# Altium schematic sheet systematic.SchDoc
size A4; SheetNumber: 1; SheetTotal: 1
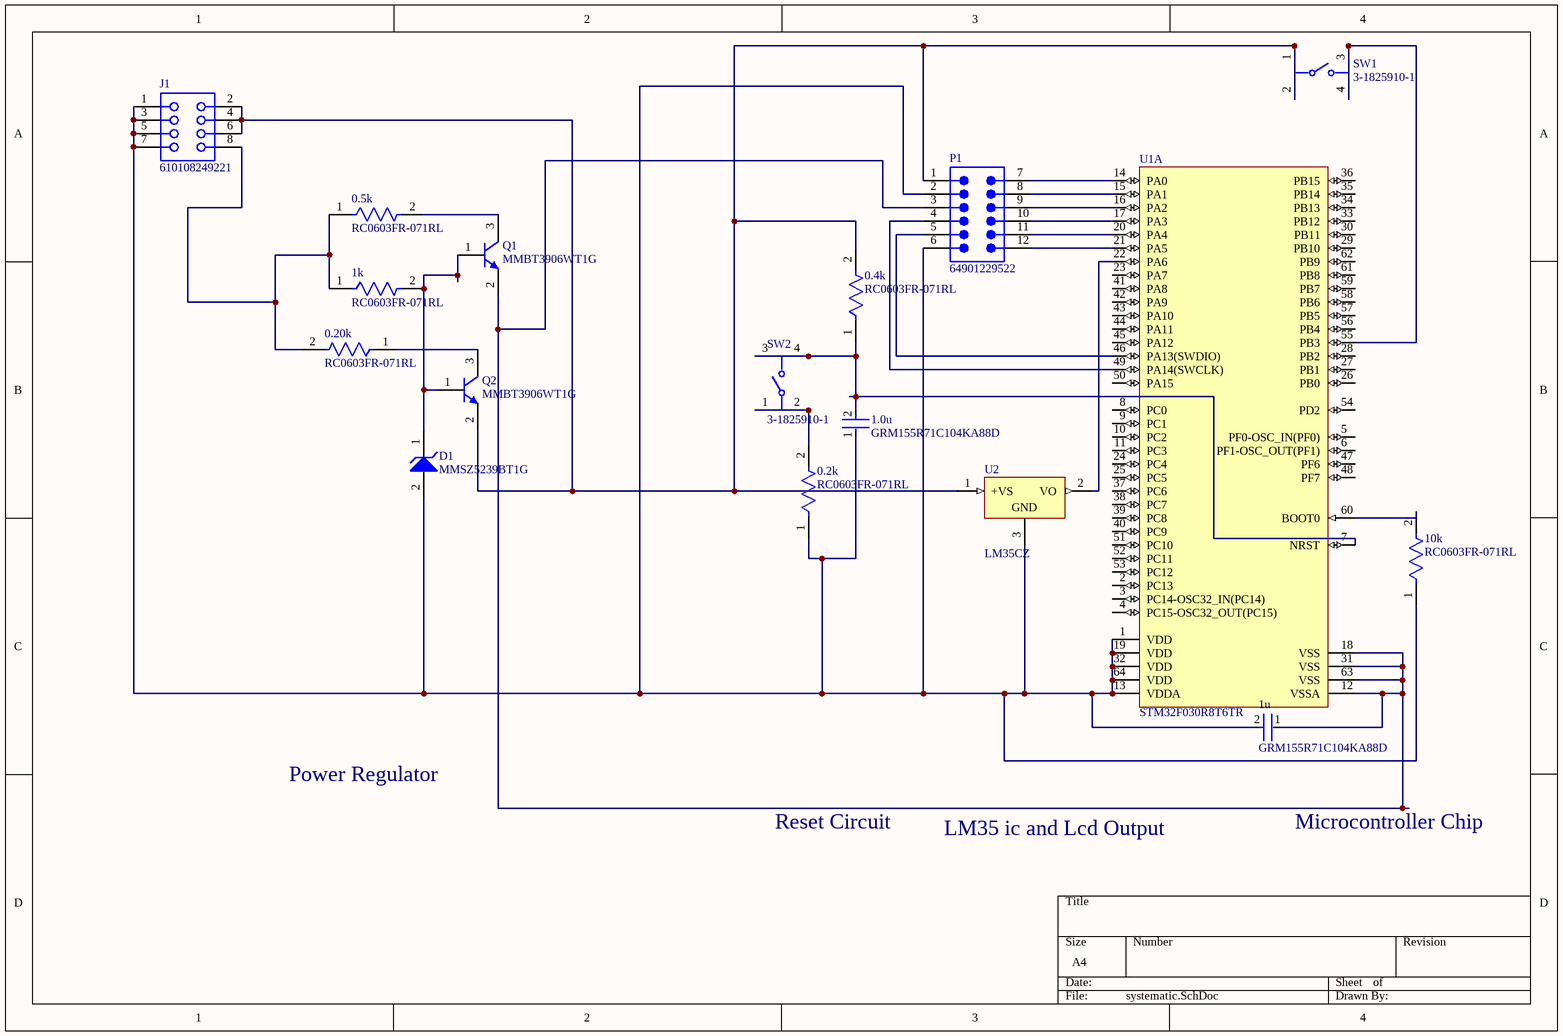
[diagram p0: systematic.SchDoc]

## Parts
0.2k  RC0603FR-071RL  [FP-RC0603-0_55-MFG]
0.4k  RC0603FR-071RL  [FP-RC0603-0_55-MFG]
0.5k  RC0603FR-071RL  [FP-RC0603-0_55-MFG]
0.20k  RC0603FR-071RL  [FP-RC0603-0_55-MFG]
1.0u  GRM155R71C104KA88D  [FP-GRM15-MFG]
1k  RC0603FR-071RL  [FP-RC0603-0_55-MFG]
1u  GRM155R71C104KA88D  [FP-GRM15-MFG]
10k  RC0603FR-071RL  [FP-RC0603-0_55-MFG]
D1  MMSZ5239BT1G  [ONSC-SOD-123-2-425-04_V]
J1  610108249221  [610108249221]
P1  64901229522  [64901229522]
Q1  MMBT3906WT1G  [ONSC-SC-70-3-419-04_V]
Q2  MMBT3906WT1G  [ONSC-SC-70-3-419-04_V]
SW1  3-1825910-1  [FP-3-1825910-1-MFG]
SW2  3-1825910-1  [FP-3-1825910-1-MFG]
U1  STM32F030R8T6TR  [STM-LQFP64_L]  (part A of 2)
U2  LM35CZ  [Z03A]

## Nets
Net0.2k_1: 0.2k.1 1.0u.1 1u.2 10k.1 D1.2(A) J1.1 J1.3 J1.5 J1.7 P1.2 P1.6 U1.1(VDD) U1.13(VDDA) U1.19(VDD) U1.32(VDD) U1.64(VDD) U2.3(GND)
Net0.2k_2: 0.2k.2 SW2.1 SW2.2
Net0.4k_1: 0.4k.1 1.0u.2 SW2.3 SW2.4 U1.7(NRST)
Net0.4k_2: 0.4k.2 J1.2 J1.4 J1.6 P1.1 Q2.2(E) SW1.1 SW1.2 U2.1(+VS)
Net0.5k_1: 0.5k.1 0.20k.2 1k.1 J1.8
Net0.5k_2: 0.5k.2 Q1.3(C)
Net0.20k_1: 0.20k.1 Q2.3(C)
Net1k_2: 1k.2 D1.1(K) Q1.1(B) Q2.1(B)
Net1u_1: 1u.1 P1.3 Q1.2(E) U1.12(VSSA) U1.18(VSS) U1.31(VSS) U1.63(VSS)
Net10k_2: 10k.2 U1.60(BOOT0)
NetP1_4: P1.4 U1.49(PA14(SWCLK))
NetP1_5: P1.5 U1.46(PA13(SWDIO))
NetP1_7: P1.7 U1.14(PA0)
NetP1_8: P1.8 U1.15(PA1)
NetP1_9: P1.9 U1.16(PA2)
NetP1_10: P1.10 U1.17(PA3)
NetP1_11: P1.11 U1.20(PA4)
NetP1_12: P1.12 U1.21(PA5)
NetSW1_3: SW1.3 SW1.4 U1.55(PB3)
NetU1_22: U1.22(PA6) U2.2(VO)

Not connected (* = marked no-connect by the designer): U1 2(PC13) 3(PC14-OSC32_IN(PC14)) 4(PC15-OSC32_OUT(PC15)) 5(PF0-OSC_IN(PF0)) 6(PF1-OSC_OUT(PF1)) 8(PC0) 9(PC1) 10(PC2) 11(PC3) 23(PA7) 24(PC4) 25(PC5) 26(PB0) 27(PB1) 28(PB2) 29(PB10) 30(PB11) 33(PB12) 34(PB13) 35(PB14) 36(PB15) 37(PC6) 38(PC7) 39(PC8) 40(PC9) 41(PA8) 42(PA9) 43(PA10) 44(PA11) 45(PA12) 47(PF6) 48(PF7) 50(PA15) 51(PC10) 52(PC11) 53(PC12) 54(PD2) 56(PB4) 57(PB5) 58(PB6) 59(PB7) 61(PB8) 62(PB9)

## Notes on the sheet
- Power Regulator
- Reset Circuit
- LM35 ic and Lcd Output
- Microcontroller Chip

## Library data of the parts
0.2k 0.4k 0.5k 0.20k 1k 10k = CMP-00621-41203676-1: RC0603FR-071RL SMD Chip Resistor, 1 Ohm, ± 1%, 100 mW, 0603 [1608 Metric], Thick Film, General Purpose; Power Rating: 100mW; Temperature Coefficient: 200ppm/°C; Voltage Rating: 50V; Resistance: 1Ω; NexarPartId: 41203676; Case Code (Imperial): 0603; Number of Terminations: 2; Composition: Thick Film; Tolerance: 1%; Max Operating Temperature: 155°C; Number of Pins: 2; Depth: 800µm; Features: Moisture Resistant; Packaging: Tape & Reel; Case/Package: 0603; REACH SVHC: Unknown; Case Code (Metric): 1608; Length: 1.6002mm; Height: 500µm; Width: 787.4µm; Termination: SMD/SMT; Min Operating Temperature: -55°C; Max Power Dissipation: 100mW; RoHS: Compliant; Lead Free: Lead Free; Schedule B: 8533210045, 8533210045; Voltage Rating (DC): 50V
1.0u 1u = CMP-2100-03641-2: CAP CER 0.1UF 16V X7R 0402; Manufacturer: Murata; Standoff Height: 0mm; Tolerance: 10%; Voltage Rating: 16Vdc; Capacitance: 0.10μF; Value: 0.10μF; RoHS: TRUE; Manufacturer Part Number: GRM155R71C104KA88D; Temperature Characteristic: X7R; Octopart: https://octopart.com/grm155r71c104ka88d-murata-196880; Digikey Description: CAP CER 0.1UF 16V X7R 0402; Device Class L3: Ceramic Capacitors; Height: 0.55mm; ComponentLink2Description: Datasheet; Temperature Range Low: -55°C; Ipc Land Pattern Name: CAPC10050X219; ComponentLink2URL: https://search.murata.co.jp/Ceramy/image/img/A01X/G101/ENG/GRM155R71H471KA01-01A.pdf; Device Class L1: Passive Components; Lead Free: yes; Category: Cap; Package: GRM15; Temperature: -55°C to +125°C; Device Class L2: Capacitors; Material: Ceramic; Temperature Range High: +125°C; Mouser Description: 0402 0.1 uF 16V ±10 % Tolerance X7R SMT Multilayer Ceramic Capacitor
D1 = CMP-1060-00547-1: Zener Voltage Regulator, 500 mW, 2-Pin SOD-123, Pb-Free, Tape and Reel; Manufacturer: On Semiconductor; P Max (W): 0.5; VZ Typ (V): 9.1; DatasheetVersion: Rev. 12; ComponentLink1Description: Manufacturer URL; ComponentLink1URL: http://www.onsemi.com/; PartNumber: MMSZ5239BT1G; ComponentLink3Description: Package Specification; PackageDescription: 2-Pin SOD, Body 1.6 x 2.69 mm; ComponentLink2Description: Datasheet; PackageVersion: Rev. G, 10/2009; ComponentLink3URL: http://www.onsemi.com/pub_link/Collateral/425-04.PDF; Packing: Tape and Reel; ComponentLink2URL: http://www.onsemi.com/pub_link/Collateral/MMSZ5221BT1-D.PDF; RoHS: Pb-Free; PackageReference: SOD-123-2-425-04; Mounting Technology: Surface Mount
J1 = CMP-1502-01388-3: NexarPartId: 52645092; Current Rating: 3A; Number of Contacts: 8; Contact Resistance: 20mΩ; Row Spacing: 2.54mm; Connector Type: Header, Socket; Gender: Female; Operating Supply Voltage: 250V; RoHS: Compliant; Number of Rows: 2; Color: Black; Mount: Surface Mount; Packaging: Tape and Reel; Number of Pins: 8; Contact Material: Copper; Lead Pitch: 2.54mm; Number of Positions: 8; Contact Plating: Gold; Termination: Solder; REACH SVHC: Unknown; Pitch: 2.54mm
P1 = CMP-1502-00522-2: NexarPartId: 23024621; Connector Type: Male Pin, Socket; Number of Positions: 12; Operating Supply Voltage: 600V; Insulation Resistance: 1GΩ; Gender: Male; Contact Resistance: 10mΩ; Current Rating: 6A; Row Spacing: 4.191mm; Pitch: 4.2mm; Contact Plating: Tin; Length: 26.4mm; Fastening Type: Ramp; Min Operating Temperature: -40°C; Width: 26.4mm; Max Operating Temperature: 105°C; Number of Rows: 2; Number of Contacts: 12; Color: White; Termination: Solder; Contact Material: Copper; Lead Pitch: 4.2mm; Number of Pins: 12; REACH SVHC: Unknown; Height: 12.8mm; RoHS: Compliant; Mount: Through Hole
Q1 Q2 = CMP-1048-00381-1: General Purpose Transistor, PNP Silicon, 3-Pin SC70, Pb-Free, Tape and Reel; Manufacturer: On Semiconductor; IC Continuous (A): -0.2; fT Min (MHz): 250; PackageDescription: 3-Pin Small Outline Transistor, Body 2 x 1.25 mm, Pitch 0.65 mm; PartNumber: MMBT3906WT1G; ComponentLink2Description: Datasheet; Packing: Tape and Reel; Mounting Technology: Surface Mount; ComponentLink3Description: Package Specification; DatasheetVersion: Rev. 8; ComponentLink2URL: http://www.onsemi.cn/pub_link/Collateral/MMBT3904WT1-D.PDF; Polarity: PNP; ComponentLink3URL: http://www.onsemi.cn/pub_link/Collateral/419-04.PDF; ComponentLink1Description: Manufacturer URL; PackageReference: SC-70-3-419-04; ComponentLink1URL: http://www.onsemi.com/; RoHS: TRUE; PackageVersion: Rev. N, 11/2008
SW1 SW2 = CMP-03407-000001-1: SWITCH TACTILE SPST-NO 0.05A 24V; Manufacturer: TE Connectivity; Operating Force: 160gf; Contact Current Rating: 50mA; Description: Switch Tactile OFF (ON) SPST Round Button PC Pins 0.05A 24VDC 100000Cycles 1.57N Thru-Hole; Contact Resistance: 100mΩ; Electromechanical Life: 100000Cycles; Device Class L1: Electromechanical; ComponentLink2URL: https://www.te.com/commerce/DocumentDelivery/DDEController?Action=srchrtrv&DocNm=1825910&DocType=Customer+Drawing&DocLang=English; Category: Switch; Device Class L2: Switches; Temperature: -35°C to +85°C; RoHS: TRUE; Mount: Through Hole; Manufacturer Part Number: 3-1825910-1; Automotive: No; Lead Free: Yes; Device Class L3: Tactile Switches; ComponentLink2Description: Datasheet; Temperature Range High: +85°C; Height: 17.3mm; Package: 0; Temperature Range Low: -35°C; Throw Configuration: SPST-NO; Digikey Description: SWITCH TACTILE SPST-NO 0.05A 24V; Octopart: https://octopart.com/3-1825910-1-te+connectivity-46506874
U1 = CMP-0304-00068-2: ARM Cortex-M0 32-bit MCU, 64 KB Flash, 8 KB Internal RAM, 55 I/Os, 64-Pin LQFP, -40 to 85 degC, Tape and Reel; Manufacturer: STMicroelectronics; Internal RAM Size (kB): 8; I/Os (High Current): 55; FLASH Size (Prog) (kB): 64; Operating Frequency(F) (Processor speed) (MHz): 48; Supply Voltage(Vcc) min (V): 2.4; Core: ARM Cortex-M0; ComponentLink1Description: Manufacturer URL; Package Reference: LQFP64; ComponentLink2URL: http://www.st.com/st-web-ui/static/active/en/resource/technical/document/datasheet/DM00088500.pdf; Mounting Technology: Surface Mount; Packing: Tape and Reel; ComponentLink1URL: http://www.st.com/; PartNumber: STM32F030R8T6TR; Package Description: 64-Pin Low-profile Quad Flat Package, Body 10 x 10 mm, Pitch 0.5 mm; DatasheetVersion: Rev. 2; ComponentLink2Description: Datasheet
U2 = CMP-0066-00027-2: Precision Centigrade Temperature Sensor, 3-pin TO-92; Manufacturer: National Semiconductor; CompType: Temp Sensor IC; PowerWise: N; PackageTopMarking: NSXYTT*LM35*CZ; ComponentLink2URL: http://www.national.com/pf/LM/LM35.html; ComponentLink2Description: LM35 Web Page; PackageDescription: TO-92, Molded, 3 Lead; PackageVersion: revG, Sep-2000; PinCount: 3; ComponentLink1Description: LM35 Datasheet; RoHS: N; ComponentLink3URL: http://www.national.com/packaging/folders/z03a.html; ComponentLink1URL: http://www.national.com/ds/LM/LM35.pdf; Code_JEDEC: TO-226-AA; ComponentLink3Description: Z03A Package Page; RevisionNote: Component URLs added; PackageReference: Z03A; DatasheetVersion: Nov-2000